# EAGLE schematic CS-O-3LED-RGB (EAGLE 6.5.0)
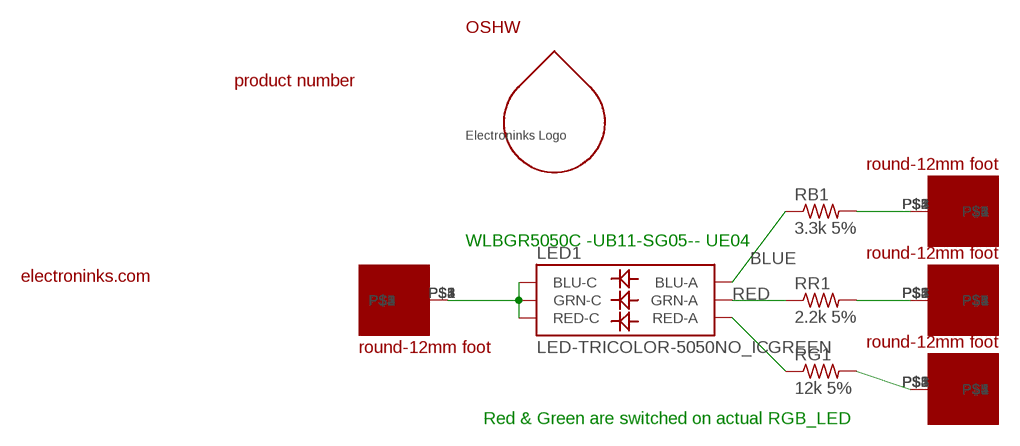
[diagram p0: schematic, sheet 1]

## Parts
LED1  LED-TRICOLOR-5050NO_IC  [LED-TRICOLOR-5050]
RB1  3.3k 5%  R-US_R0603  [R0603]
RG1  12k 5%  R-US_R0603  [R0603]
RR1  2.2k 5%  R-US_R0603  [R0603]
U$1  ROUND-12MM-FOOT-1.8MM  [ROUND-12MM-FOOT]
U$2  ELECTRONINKS_COM_15MM  [ELECTRONINKS_COM_15MM]
U$2-GREEN  ROUND-12MM-FOOT-1.8MM  [ROUND-12MM-FOOT]
U$3  DROPLET_LOGO_4MM  [DROPLET_LOGO_4MM]
U$3-RED  ROUND-12MM-FOOT-1.8MM  [ROUND-12MM-FOOT]
U$4  OSHW_4MM  [OHSW_4MM]
U$4-BLUE  ROUND-12MM-FOOT-1.8MM  [ROUND-12MM-FOOT]
U$5  ELECTRONINKS_LOGO_15MM  [ELECTRONINKS_LOGO_15MM]
U$6  CS_O_3LED_RGB  [CS_O_3LED_RGB]

## Nets
BLUE: LED1.3(BLU-A) RB1.1
GREEN: LED1.2(RED-A) RG1.1
N$1: LED1.4(BLU-C) LED1.5(RED-C) LED1.6(GRN-C) U$1.P$1
N$5: RR1.2 U$3-RED.P$1 U$3-RED.P$2 U$3-RED.P$3 U$3-RED.P$4 U$3-RED.P$5
N$6: RB1.2 U$4-BLUE.P$1 U$4-BLUE.P$2 U$4-BLUE.P$3 U$4-BLUE.P$4 U$4-BLUE.P$5
N$7: RG1.2 U$2-GREEN.P$1 U$2-GREEN.P$2 U$2-GREEN.P$3 U$2-GREEN.P$4 U$2-GREEN.P$5
RED: LED1.1(GRN-A) RR1.1
Unconnected: U$1.P$2 U$1.P$3 U$1.P$4 U$1.P$5

## Notes on the sheet
- WLBGR5050C -UB11-SG05-- UE04
- Red & Green are switched on actual RGB_LED

## Library data of the parts
LED1 = SparkFun-LED:LED-TRICOLOR-5050
RB1 RG1 RR1 = rcl:R-US_: RESISTOR, American symbol
U$1 U$2-GREEN U$3-RED U$4-BLUE = electroninks:ROUND-12MM-FOOT-1.8MM
U$2 = electroninks:ELECTRONINKS_COM_15MM
U$3 = electroninks:DROPLET_LOGO_4MM
U$4 = electroninks:OSHW_4MM
U$5 = electroninks:ELECTRONINKS_LOGO_15MM
U$6 = electroninks:CS_O_3LED_RGB